# EAGLE design main (EAGLE 8.3.1)
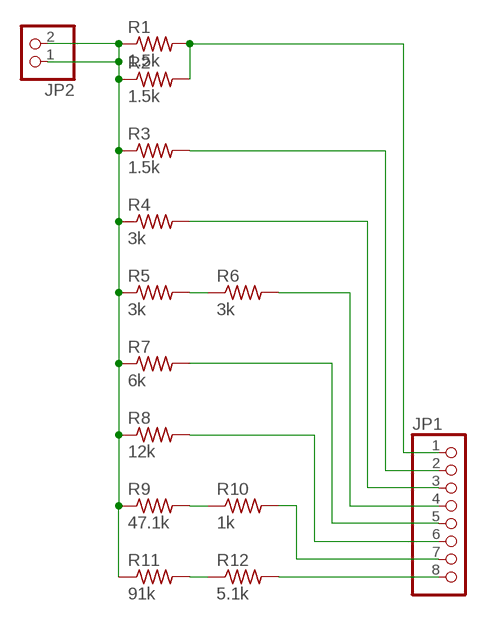
[diagram p0: schematic, sheet 1]

## Parts
JP1  PINHD-1X8  [1X08]
JP2  PINHD-1X2  [1X02]
R1  1.5k  R-US_0309/10  [0309/10]
R2  1.5k  R-US_0309/10  [0309/10]
R3  1.5k  R-US_0309/10  [0309/10]
R4  3k  R-US_0309/10  [0309/10]
R5  3k  R-US_0309/10  [0309/10]
R6  3k  R-US_0309/10  [0309/10]
R7  6k  R-US_0309/10  [0309/10]
R8  12k  R-US_0309/10  [0309/10]
R9  47.1k  R-US_0309/10  [0309/10]
R10  1k  R-US_0309/10  [0309/10]
R11  91k  R-US_0309/10  [0309/10]
R12  5.1k  R-US_0309/10  [0309/10]

## Nets
N$1: JP2.1 JP2.2 R1.1 R2.1 R3.1 R4.1 R5.1 R7.1 R8.1 R9.1 R11.1
N$2: JP1.1 R1.2 R2.2
N$3: JP1.2 R3.2
N$4: JP1.8 R12.2
N$5: R5.2 R6.1
N$6: R9.2 R10.1
N$7: R11.2 R12.1
N$8: JP1.3 R4.2
N$9: JP1.4 R6.2
N$10: JP1.5 R7.2
N$11: JP1.6 R8.2
N$12: JP1.7 R10.2

## Library data of the parts
JP1 = pinhead:PINHD-1X8: PIN HEADER
JP2 = pinhead:PINHD-1X2: PIN HEADER
R1-R12 = rcl:R-US_: RESISTOR, American symbol

## Board
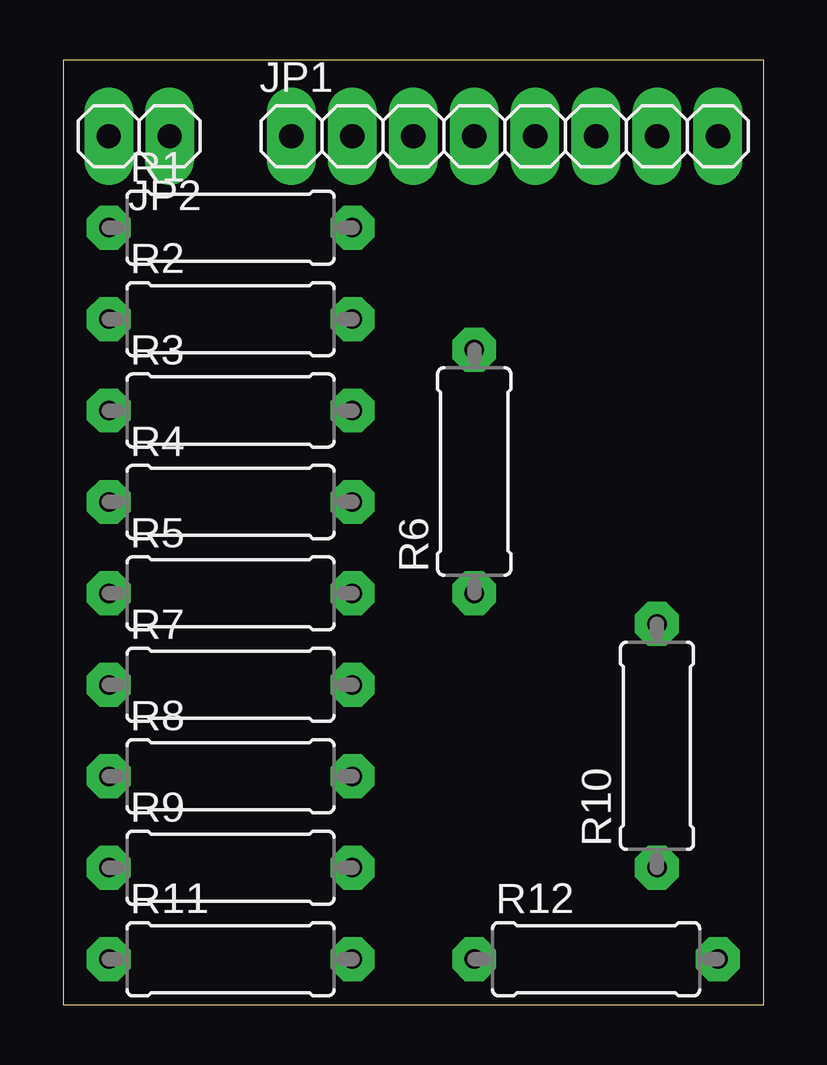
[diagram p1: board, top side]
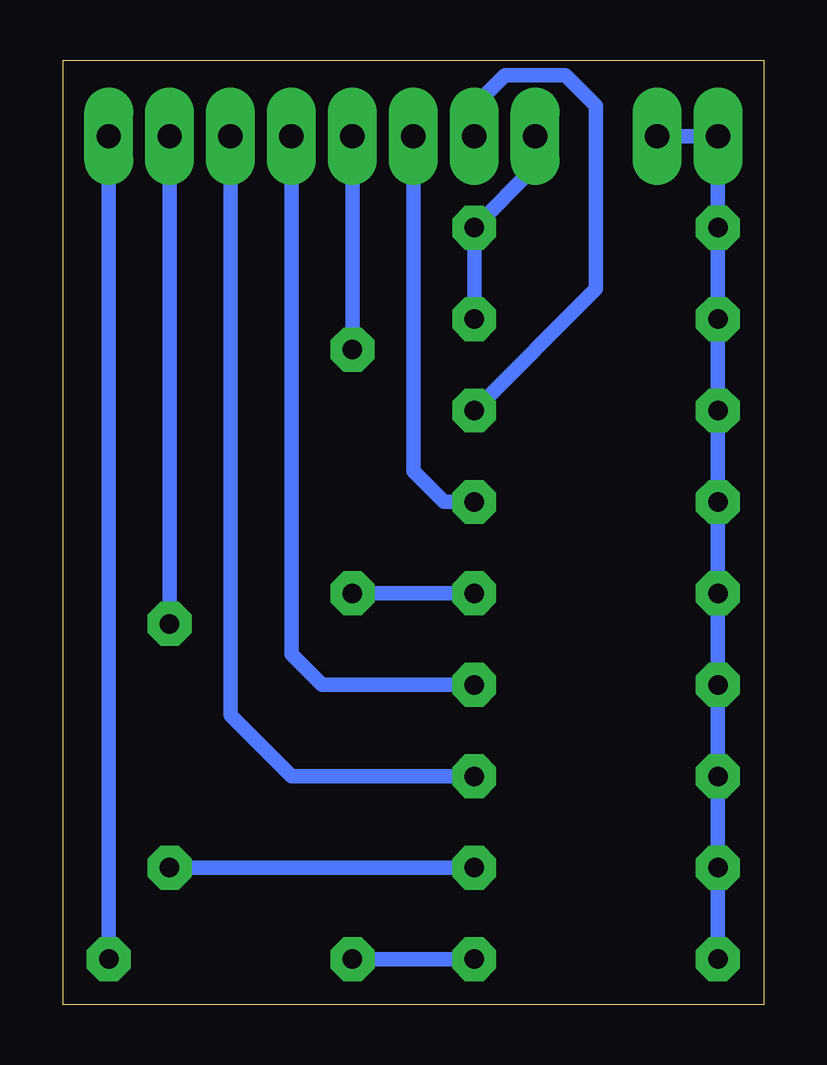
[diagram p2: board, bottom side, seen from below]

Size 29.21 x 39.37 mm. Coordinates in mm from the lower left corner, seen from the top.
Outline: 0,0 29.21,0 29.21,39.37 0,39.37 0,0
Copper layers (1*16): Top 0.035mm / dielectric 1.5mm / Bottom 0.035mm
Design rules "default *": minimum track width 6mil, minimum drill 0.35mm, track to track 6mil, track to pad 6mil, pad to pad 6mil, via to via 6mil, smd to smd 6mil, copper to edge 40mil, drill to drill 6mil, minimum pad ring 20mil, minimum via ring 8mil, stop-mask expansion 4mil, vias tented up to drill 0mil, thermal gap 10mil

### Footprints (pad centres in the part's own frame; a part is rotated, then mirrored left to right if it is on the bottom)
1X08 = drill 1.016 long: 1 -8.89,0; 2 -6.35,0; 3 -3.81,0; 4 -1.27,0; 5 1.27,0; 6 3.81,0; 7 6.35,0; 8 8.89,0
1X02 = drill 1.016 long: 1 -1.27,0; 2 1.27,0
0309/10 = drill 0.813 octagon: 1 -5.08,0; 2 5.08,0

### Placement (x,y rotation side)
JP1  18.41,36.19 0 top
JP2  3.18,36.19 180 top
R1  6.98,32.39 0 top
R2  6.98,28.57 0 top
R3  6.98,24.76 0 top
R4  6.98,20.96 0 top
R5  6.98,17.14 0 top
R6  17.14,22.22 90 top
R7  6.98,13.33 0 top
R8  6.98,9.53 0 top
R9  6.98,5.71 0 top
R10  24.77,10.79 90 top
R11  6.98,1.91 0 top
R12  22.23,1.91 0 top

### Tracks (layer width: path | path; a pad name or v marks a point on that pad's centre or on a via)
N$1
  Bottom 0.61: JP2.1 JP2.2 R1.1 R2.1 R3.1 R4.1 R5.1 R7.1 R8.1 R9.1 R11.1
N$2
  Bottom 0.61: JP1.1 9.52,34.92 R1.2 R2.2
N$3
  Bottom 0.61: JP1.2 12.06,37.47 10.8,38.73 8.26,38.73 6.98,37.47 6.98,29.85 R3.2
N$4
  Bottom 0.61: R12.2 JP1.8
N$5
  Bottom 0.61: R5.2 R6.1
N$6
  Bottom 0.61: R10.1 R9.2
N$7
  Bottom 0.61: R11.2 R12.1
N$8
  Bottom 0.61: JP1.3 14.6,22.22 13.34,20.96 R4.2
N$9
  Bottom 0.61: R6.2 JP1.4
N$10
  Bottom 0.61: JP1.5 19.69,14.61 18.41,13.33 R7.2
N$11
  Bottom 0.61: R8.2 19.69,9.53 22.23,12.07 JP1.6
N$12
  Bottom 0.61: JP1.7 R10.2

### Text on the board
bKeepout: 8 BIT DAC